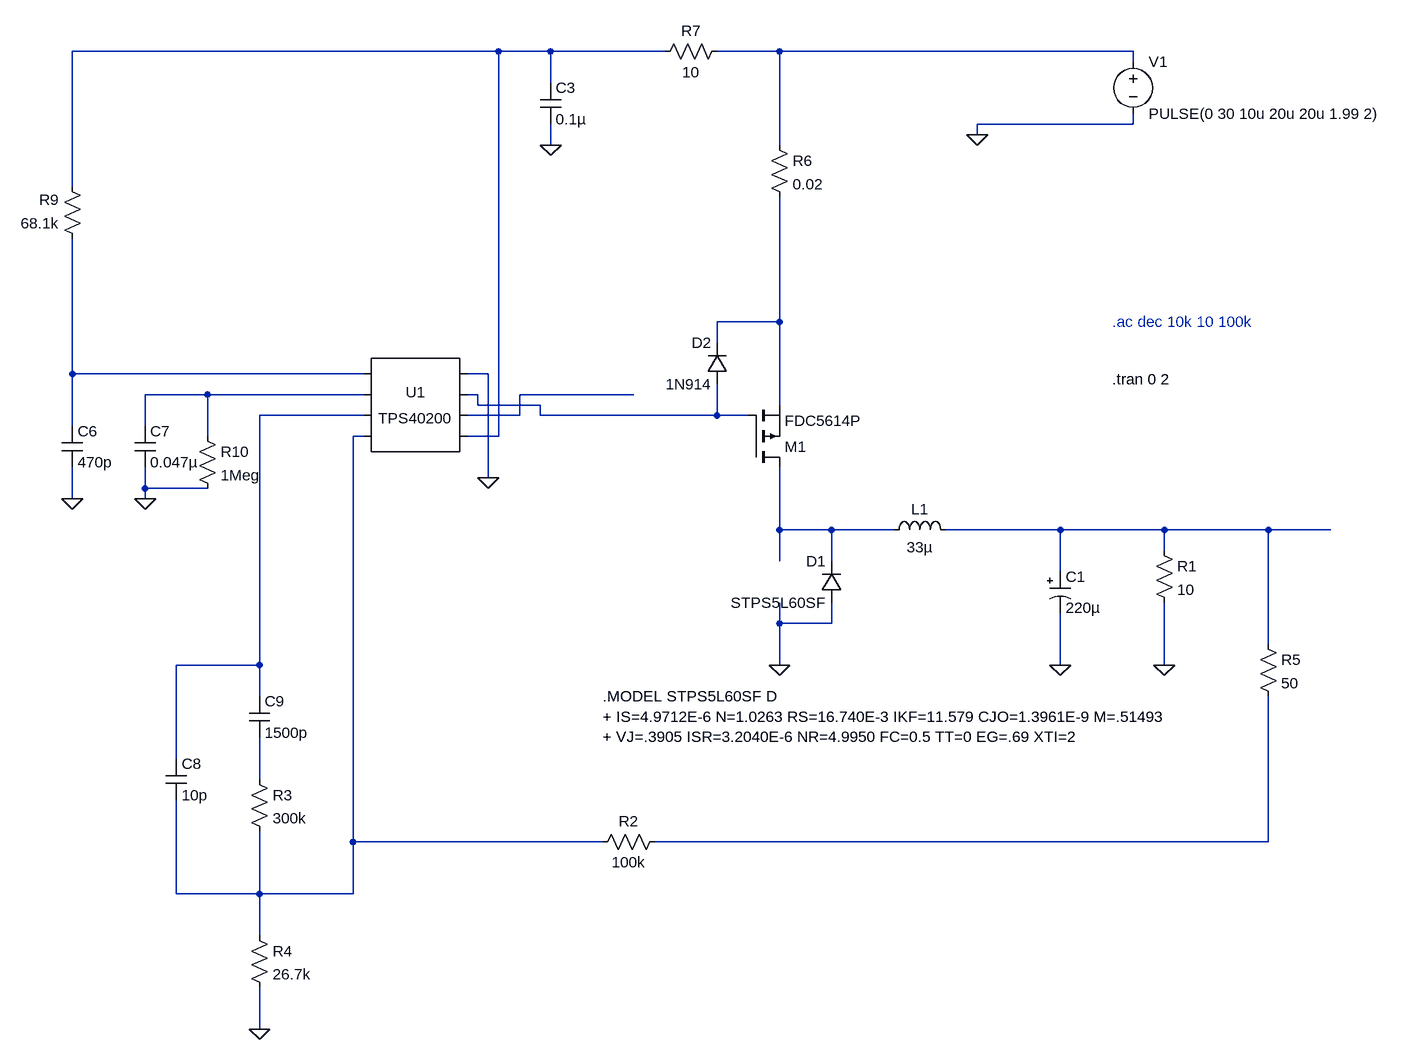
[diagram p0: schematic Buck_design_v1.asc]
Buck_design_v1.asc, the LTspice schematic file:
Version 4
SHEET 1 1552 1056
WIRE -272 -464 -928 -464
WIRE -192 -464 -272 -464
WIRE -16 -464 -192 -464
WIRE 160 -464 64 -464
WIRE 704 -464 160 -464
WIRE 704 -448 704 -464
WIRE -192 -416 -192 -464
WIRE 704 -352 704 -368
WIRE 704 -352 464 -352
WIRE 464 -336 464 -352
WIRE -192 -320 -192 -352
WIRE 160 -320 160 -464
WIRE -928 -256 -928 -464
WIRE 160 -48 160 -240
WIRE 160 -48 64 -48
WIRE 64 -16 64 -48
WIRE -928 32 -928 -176
WIRE -480 32 -928 32
WIRE -288 32 -320 32
WIRE -720 64 -816 64
WIRE -480 64 -720 64
WIRE -304 64 -320 64
WIRE -64 64 -240 64
WIRE -304 80 -304 64
WIRE -208 80 -304 80
WIRE 160 80 160 -48
WIRE -480 96 -640 96
WIRE -240 96 -240 64
WIRE -240 96 -320 96
WIRE -208 96 -208 80
WIRE 64 96 64 48
WIRE 64 96 -208 96
WIRE 112 96 64 96
WIRE -928 112 -928 32
WIRE -816 112 -816 64
WIRE -720 128 -720 64
WIRE -480 128 -496 128
WIRE -272 128 -272 -464
WIRE -272 128 -320 128
WIRE -288 192 -288 32
WIRE -816 208 -816 176
WIRE -720 208 -816 208
WIRE -928 224 -928 176
WIRE -816 224 -816 208
WIRE 160 272 160 176
WIRE 240 272 160 272
WIRE 336 272 240 272
WIRE 592 272 416 272
WIRE 752 272 592 272
WIRE 912 272 752 272
WIRE 1008 272 912 272
WIRE 752 304 752 272
WIRE 160 320 160 272
WIRE 240 320 240 272
WIRE 592 336 592 272
WIRE 160 416 160 384
WIRE 240 416 240 384
WIRE 240 416 160 416
WIRE 912 448 912 272
WIRE -640 480 -640 96
WIRE -640 480 -768 480
WIRE 160 480 160 416
WIRE 592 480 592 400
WIRE 752 480 752 384
WIRE -640 528 -640 480
WIRE -768 624 -768 480
WIRE -640 656 -640 592
WIRE -496 752 -496 128
WIRE -112 752 -496 752
WIRE 912 752 912 528
WIRE 912 752 -32 752
WIRE -768 832 -768 688
WIRE -640 832 -640 736
WIRE -640 832 -768 832
WIRE -496 832 -496 752
WIRE -496 832 -640 832
WIRE -640 896 -640 832
WIRE -640 1040 -640 976
FLAG 160 480 0
FLAG 592 480 0
FLAG 752 480 0
FLAG -288 192 0
FLAG -928 224 0
FLAG -816 224 0
FLAG -640 1040 0
FLAG 464 -336 0
FLAG -192 -320 0
SYMBOL polcap 576 336 R0
WINDOW 3 24 56 Left 2
SYMATTR Value 220µ
SYMATTR InstName C1
SYMATTR Description Capacitor
SYMATTR Type cap
SYMATTR SpiceLine Rser=12m Lser=0 mfg="   ---" pn="   ---" type="   ---"
SYMBOL ind 320 288 R270
WINDOW 0 32 56 VTop 2
WINDOW 3 5 56 VBottom 2
SYMATTR InstName L1
SYMATTR Value 33µ
SYMATTR SpiceLine Ipk=6.22 Rser=60m Rpar=infin. Cpar=0 mfg="Coiltronics" pn="DR127-330-R"
SYMBOL voltage 704 -464 R0
SYMATTR InstName V1
SYMATTR Value PULSE(0 30 10u 20u 20u 1.99 2)
SYMBOL res -16 736 R90
WINDOW 0 0 56 VBottom 2
WINDOW 3 32 56 VTop 2
SYMATTR InstName R2
SYMATTR Value 100k
SYMBOL res 736 288 R0
SYMATTR InstName R1
SYMATTR Value 10
SYMBOL res 896 432 R0
SYMATTR InstName R5
SYMATTR Value 50
SYMBOL pmos 112 176 M180
SYMATTR InstName M1
SYMATTR Value FDC5614P
SYMBOL res 144 -336 R0
SYMATTR InstName R6
SYMATTR Value 0.02
SYMBOL res 80 -480 R90
WINDOW 0 0 56 VBottom 2
WINDOW 3 32 56 VTop 2
SYMATTR InstName R7
SYMATTR Value 10
SYMBOL res -912 -160 R180
WINDOW 0 36 76 Left 2
WINDOW 3 36 40 Left 2
SYMATTR InstName R9
SYMATTR Value 68.1k
SYMBOL cap -208 -416 R0
SYMATTR InstName C3
SYMATTR Value 0.1µ
SYMBOL cap -944 112 R0
SYMATTR InstName C6
SYMATTR Value 470p
SYMBOL cap -832 112 R0
SYMATTR InstName C7
SYMATTR Value 0.047µ
SYMBOL res -736 112 R0
SYMATTR InstName R10
SYMATTR Value 1Meg
SYMBOL cap -784 624 R0
SYMATTR InstName C8
SYMATTR Value 10p
SYMBOL cap -656 528 R0
SYMATTR InstName C9
SYMATTR Value 1500p
SYMBOL res -656 640 R0
SYMATTR InstName R3
SYMATTR Value 300k
SYMBOL res -656 880 R0
SYMATTR InstName R4
SYMATTR Value 26.7k
SYMBOL diode 256 384 R180
WINDOW 0 24 64 Left 2
WINDOW 3 24 0 Left 2
SYMATTR InstName D1
SYMATTR Value STPS5L60SF
SYMBOL AutoGenerated/TPS40200 -400 80 R0
SYMATTR InstName U1
SYMBOL diode 80 48 R180
WINDOW 0 24 64 Left 2
WINDOW 3 24 0 Left 2
SYMATTR InstName D2
SYMATTR Value 1N914
TEXT 672 -48 Left 2 ;.ac dec 10k 10 100k
TEXT 672 40 Left 2 !.tran 0 2
TEXT -112 528 Left 2 !.MODEL STPS5L60SF D\n+ IS=4.9712E-6 N=1.0263 RS=16.740E-3 IKF=11.579 CJO=1.3961E-9 M=.51493\n+ VJ=.3905 ISR=3.2040E-6 NR=4.9950 FC=0.5 TT=0 EG=.69 XTI=2

The netlist it stands for:
* Buck_design_v1.asc
C1 N011 0 220µ Rser=12m Lser=0 mfg="   ---" pn="   ---" type="   ---"
L1 N010 N011 33µ Ipk=6.22 Rser=60m Rpar=infin. Cpar=0 mfg="Coiltronics" pn="DR127-330-R"
V1 N002 0 PULSE(0 30 10u 20u 20u 1.99 2)
R2 N013 N009 100k
R1 N011 0 10
R5 N011 N013 50
M1 N010 N006 N003 N003 FDC5614P
R6 N002 N003 0.02
R7 N002 N001 10
R9 N004 N001 68.1k
C3 N001 0 0.1µ
C6 N004 0 470p
C7 N005 0 0.047µ
R10 N005 0 1Meg
C8 N008 N009 10p
C9 N008 N012 1500p
R3 N012 N009 300k
R4 N009 0 26.7k
D1 0 N010 STPS5L60SF
* U1: TPS40200 (symbol AutoGenerated/TPS40200 not available, pins judged from their places): pin1=N004 pin2=N005 pin3=N008 pin4=N009 pin5=0 pin6=N006 pin7=N007 pin8=N001
D2 N006 N003 1N914
.model D D
.lib standard.dio
.model NMOS NMOS
.model PMOS PMOS
.lib standard.mos
* .ac dec 10k 10 100k
.tran 0 2
.MODEL STPS5L60SF D
+ IS=4.9712E-6 N=1.0263 RS=16.740E-3 IKF=11.579 CJO=1.3961E-9 M=.51493
+ VJ=.3905 ISR=3.2040E-6 NR=4.9950 FC=0.5 TT=0 EG=.69 XTI=2
.backanno
.end